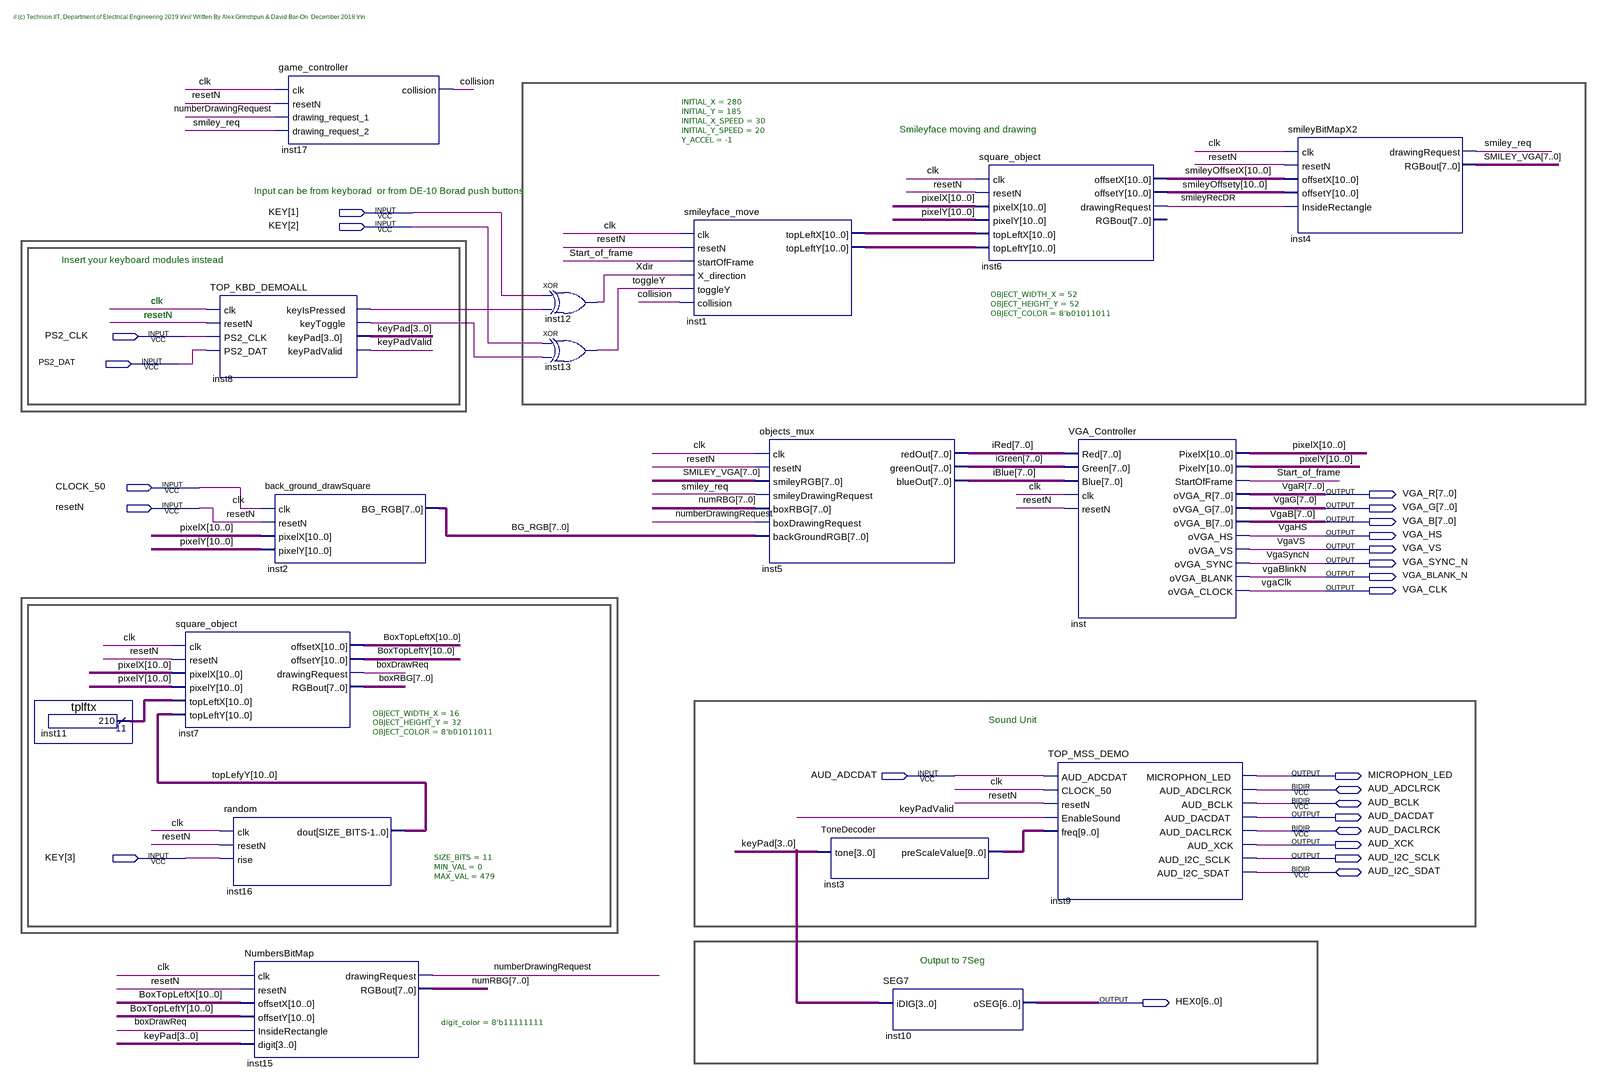
[diagram p0: schematic sheet]
// Quartus schematic TOP_VGA_DEMO_WITH_MSS_ALL.bdf as structural Verilog: 17 symbols, 25 pins
module TOP_VGA_DEMO_WITH_MSS_ALL (
  input  [3:1] KEY,
  input  PS2_CLK,
  input  PS2_DAT,
  input  CLOCK_50,
  input  resetN,
  input  AUD_ADCDAT,
  inout  AUD_ADCLRCK,
  inout  AUD_BCLK,
  inout  AUD_DACLRCK,
  inout  AUD_I2C_SDAT,
  output [7:0] VGA_R,
  output [7:0] VGA_G,
  output [7:0] VGA_B,
  output VGA_HS,
  output VGA_VS,
  output VGA_SYNC_N,
  output VGA_BLANK_N,
  output VGA_CLK,
  output MICROPHON_LED,
  output AUD_DACDAT,
  output AUD_XCK,
  output AUD_I2C_SCLK,
  output [6:0] HEX0
);

  wire boxDrawReq, collision, inst8_keyispressed, inst8_keytoggle, keyPadValid, numberDrawingRequest,
       smiley_req, smileyRecDR, Start_of_frame, toggleY, Xdir;
  wire [3:0] keyPad;
  wire [7:0] BG_RGB, boxRBG, iBlue, iGreen, iRed, numRBG, SMILEY_VGA;
  wire [9:0] inst3_prescalevalue;
  wire [10:0] BoxTopLeftX, BoxTopLeftY, inst1_topleftx, inst1_toplefty, inst11_result, pixelX, pixelY,
       smileyOffsetX, smileyOffsety, topLefyY;

  tplftx inst11 (.result(inst11_result));
  TOP_KBD_DEMOALL inst8 (
    .clk(CLOCK_50), .resetN(resetN), .PS2_CLK(PS2_CLK), .PS2_DAT(PS2_DAT), .keyIsPressed(inst8_keyispressed),
    .keyToggle(inst8_keytoggle), .keyPad(keyPad), .keyPadValid(keyPadValid));
  square_object #(.OBJECT_WIDTH_X(16), .OBJECT_HEIGHT_Y(32), .OBJECT_COLOR(8'b01011011)) inst7 (
    .clk(CLOCK_50), .resetN(resetN), .pixelX(pixelX), .pixelY(pixelY), .topLeftX(inst11_result),
    .topLeftY(topLefyY), .offsetX(BoxTopLeftX), .offsetY(BoxTopLeftY), .drawingRequest(boxDrawReq),
    .RGBout(boxRBG));
  back_ground_drawSquare inst2 (.clk(CLOCK_50), .resetN(resetN), .pixelX(pixelX), .pixelY(pixelY), .BG_RGB(BG_RGB));
  random #(.SIZE_BITS(11), .MIN_VAL(0), .MAX_VAL(479)) inst16 (
    .clk(CLOCK_50), .resetN(resetN), .rise(KEY[3]), .dout(topLefyY));
  NumbersBitMap #(.digit_color(8'b11111111)) inst15 (
    .clk(CLOCK_50), .resetN(resetN), .offsetX(BoxTopLeftX), .offsetY(BoxTopLeftY),
    .InsideRectangle(boxDrawReq), .digit(keyPad), .drawingRequest(numberDrawingRequest), .RGBout(numRBG));
  game_controller inst17 (
    .clk(CLOCK_50), .resetN(resetN), .drawing_request_1(numberDrawingRequest),
    .drawing_request_2(smiley_req), .collision(collision));
  xor inst12 (Xdir, KEY[1], inst8_keyispressed);
  xor inst13 (toggleY, KEY[2], inst8_keytoggle);
  smileyface_move #(.INITIAL_X(280), .INITIAL_Y(185), .INITIAL_X_SPEED(30), .INITIAL_Y_SPEED(20), .Y_ACCEL(-1)) inst1 (
    .clk(CLOCK_50), .resetN(resetN), .startOfFrame(Start_of_frame), .X_direction(Xdir), .toggleY(toggleY),
    .collision(collision), .topLeftX(inst1_topleftx), .topLeftY(inst1_toplefty));
  objects_mux inst5 (
    .clk(CLOCK_50), .resetN(resetN), .smileyRGB(SMILEY_VGA), .smileyDrawingRequest(smiley_req),
    .boxRBG(numRBG), .boxDrawingRequest(numberDrawingRequest), .backGroundRGB(BG_RGB), .redOut(iRed),
    .greenOut(iGreen), .blueOut(iBlue));
  ToneDecoder inst3 (.tone(keyPad), .preScaleValue(inst3_prescalevalue));
  SEG7 inst10 (.iDIG(keyPad), .oSEG(HEX0));
  square_object #(.OBJECT_WIDTH_X(52), .OBJECT_HEIGHT_Y(52), .OBJECT_COLOR(8'b01011011)) inst6 (
    .clk(CLOCK_50), .resetN(resetN), .pixelX(pixelX), .pixelY(pixelY), .topLeftX(inst1_topleftx),
    .topLeftY(inst1_toplefty), .offsetX(smileyOffsetX), .offsetY(smileyOffsety), .drawingRequest(smileyRecDR));  // open: RGBout
  VGA_Controller inst (
    .Red(iRed), .Green(iGreen), .Blue(iBlue), .clk(CLOCK_50), .resetN(resetN), .PixelX(pixelX),
    .PixelY(pixelY), .StartOfFrame(Start_of_frame), .oVGA_R(VGA_R), .oVGA_G(VGA_G), .oVGA_B(VGA_B),
    .oVGA_HS(VGA_HS), .oVGA_VS(VGA_VS), .oVGA_SYNC(VGA_SYNC_N), .oVGA_BLANK(VGA_BLANK_N), .oVGA_CLOCK(VGA_CLK));
  TOP_MSS_DEMO inst9 (
    .AUD_ADCDAT(AUD_ADCDAT), .CLOCK_50(CLOCK_50), .resetN(resetN), .EnableSound(keyPadValid),
    .freq(inst3_prescalevalue), .MICROPHON_LED(MICROPHON_LED), .AUD_DACDAT(AUD_DACDAT), .AUD_XCK(AUD_XCK),
    .AUD_I2C_SCLK(AUD_I2C_SCLK), .AUD_ADCLRCK(AUD_ADCLRCK), .AUD_BCLK(AUD_BCLK), .AUD_DACLRCK(AUD_DACLRCK),
    .AUD_I2C_SDAT(AUD_I2C_SDAT));
  smileyBitMapX2 inst4 (
    .clk(CLOCK_50), .resetN(resetN), .offsetX(smileyOffsetX), .offsetY(smileyOffsety),
    .InsideRectangle(smileyRecDR), .drawingRequest(smiley_req), .RGBout(SMILEY_VGA));

  // Other names for the same wires on the sheet: clk = CLOCK_50; VgaB[7:0] = VGA_B; vgaBlinkN = VGA_BLANK_N;
  //   vgaClk = VGA_CLK; VgaG[7:0] = VGA_G; VgaHS = VGA_HS; VgaR[7:0] = VGA_R; VgaSyncN = VGA_SYNC_N; VgaVS = VGA_VS

  // Notes on the sheet:
  //   // (c) Technion IIT, Department of Electrical Engineering 2019 \r\n// Written By Alex Grinshpun & David Bar-On  December 2018 \r\n
  //   Smileyface moving and drawing
  //   Input can be from keyborad  or from DE-10 Borad push buttons  
  //   Insert your keyboard modules instead
  //   clk
  //   resetN
  //   Sound Unit
  //   Output to 7Seg
endmodule
